# EAGLE design max3002 (EAGLE 5.10)
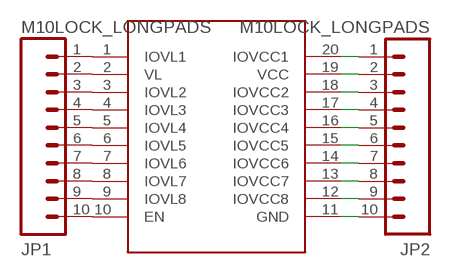
[diagram p0: schematic, sheet 1]

## Parts
JP1  M10LOCK_LONGPADS  [1X10_LOCK_LONGPADS]
JP2  M10LOCK_LONGPADS  [1X10_LOCK_LONGPADS]
U$1  MAX3002  [TSSOP20]

## Nets
N$1: JP1.1 U$1.1(IOVL1)
N$2: JP1.2 U$1.2(VL)
N$3: JP1.3 U$1.3(IOVL2)
N$4: JP1.4 U$1.4(IOVL3)
N$5: JP1.5 U$1.5(IOVL4)
N$6: JP1.6 U$1.6(IOVL5)
N$7: JP1.7 U$1.7(IOVL6)
N$8: JP1.8 U$1.8(IOVL7)
N$9: JP1.9 U$1.9(IOVL8)
N$10: JP1.10 U$1.10(EN)
N$11: JP2.1 U$1.20(IOVCC1)
N$12: JP2.2 U$1.19(VCC)
N$13: JP2.3 U$1.18(IOVCC2)
N$14: JP2.4 U$1.17(IOVCC3)
N$15: JP2.5 U$1.16(IOVCC4)
N$16: JP2.6 U$1.15(IOVCC5)
N$17: JP2.7 U$1.14(IOVCC6)
N$18: JP2.8 U$1.13(IOVCC7)
N$19: JP2.9 U$1.12(IOVCC8)
N$20: JP2.10 U$1.11(GND)

## Library data of the parts
JP1 JP2 = SparkFun:M10: Header 10 Standard 10-pin 0.1" header. Use with straight break away headers (SKU : PRT-00116), right angle break away headers (PRT-00553), swiss pins (PRT-00743), machine pins (PRT-00117), and female headers (PRT-00115).
U$1 = ideabot:MAX3002

## Board
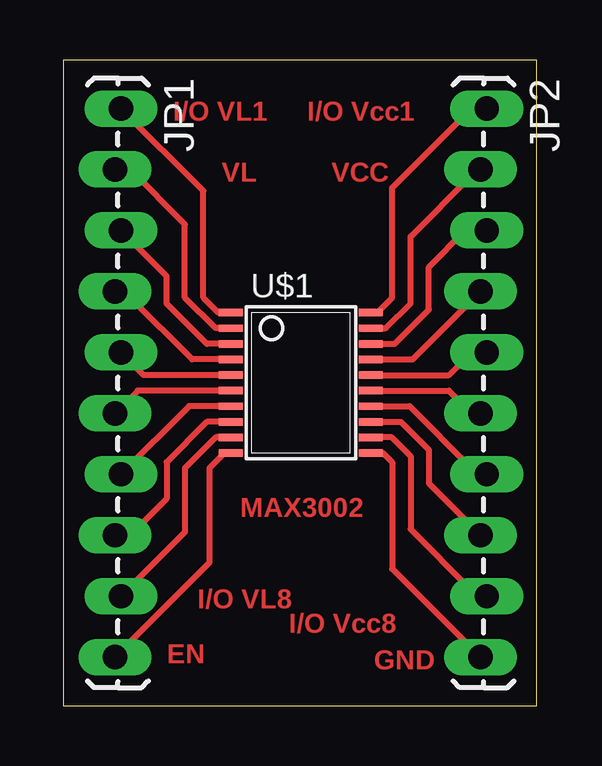
[diagram p1: board, top side]

Size 19.74 x 26.91 mm. Coordinates in mm from the lower left corner, seen from the top.
Outline: 0,0 19.74,0 19.74,26.91 0,26.91 0,0
Copper layers (1*16): Top 0.035mm / dielectric 1.5mm / Bottom 0.035mm
Design rules "default": minimum track width 10mil, minimum drill 24mil, track to track 8mil, track to pad 8mil, pad to pad 8mil, via to via 8mil, smd to smd 8mil, copper to edge 40mil, drill to drill 8mil, minimum pad ring 10mil, minimum via ring 8mil, stop-mask expansion 4mil, vias tented up to drill 0mil, thermal gap 10mil

### Footprints (pad centres in the part's own frame; a part is rotated, then mirrored left to right if it is on the bottom)
1X10_LOCK_LONGPADS = drill 1.016 long: 1 0,0.127; 2 2.54,-0.127; 3 5.08,0.127; 4 7.62,-0.127; 5 10.16,0.127; 6 12.7,-0.127; 7 15.24,0.127; 8 17.78,-0.127; 9 20.32,0.127; 10 22.86,-0.127
TSSOP20 = smd 0.305 x 0.991: 1 -2.925,-2.918; 2 -2.275,-2.918; 3 -1.625,-2.918; 4 -0.975,-2.918; 5 -0.325,-2.918; 6 0.325,-2.918; 7 0.975,-2.918; 8 1.625,-2.918; 9 2.275,-2.918; 10 2.925,-2.918; 11 2.925,2.918; 12 2.275,2.918; 13 1.625,2.918; 14 0.975,2.918; 15 0.325,2.918; 16 -0.325,2.918; 17 -0.975,2.918; 18 -1.625,2.918; 19 -2.275,2.918; 20 -2.925,2.918

### Placement (x,y rotation side)
JP1  2.29,24.89 270 top
JP2  17.53,24.89 270 top
U$1  9.91,13.46 270 top

### Tracks (layer width: path | path; a pad name or v marks a point on that pad's centre or on a via)
N$1
  Top 0.254: U$1.1 6.47,16.39 5.84,17.02 5.84,21.46 JP1.1
N$2
  Top 0.254: U$1.2 6.36,15.74 5.08,17.02 5.08,20.07 2.79,22.35 JP1.2
N$3
  Top 0.254: U$1.3 5.99,15.09 4.32,16.76 4.32,17.91 JP1.3
N$4
  Top 0.254: U$1.4 5.38,14.44 2.79,17.02 2.41,17.02 JP1.4
N$5
  Top 0.254: U$1.5 3.36,13.79 JP1.5
N$6
  Top 0.254: U$1.6 3.1,13.14 JP1.6
N$7
  Top 0.254: U$1.7 5.25,12.49 JP1.7
N$8
  Top 0.254: U$1.8 5.99,11.84 4.32,10.16 4.32,8.64 2.79,7.11 JP1.8
N$9
  Top 0.254: U$1.9 6.36,11.19 5.08,9.91 5.08,7.24 JP1.9
N$10
  Top 0.254: U$1.10 6.73,10.54 6.1,9.91 6.1,5.97 JP1.10
N$11
  Top 0.254: U$1.20 13.09,16.39 13.72,17.02 13.72,21.59 17.02,24.89 JP2.1
N$12
  Top 0.254: U$1.19 13.45,15.74 14.48,16.76 14.48,19.56 17.02,22.1 17.14,22.1 JP2.2
N$13
  Top 0.254: U$1.18 13.82,15.09 15.24,16.51 15.24,18.29 16.76,19.81 JP2.3
N$14
  Top 0.254: U$1.17 14.56,14.44 JP2.4
N$15
  Top 0.254: U$1.16 16.07,13.79 17.02,14.73 JP2.5
N$16
  Top 0.254: U$1.15 16.07,13.14 16.76,12.45 17.14,12.45 JP2.6
N$17
  Top 0.254: U$1.14 14.44,12.49 17.02,9.91 17.4,9.91 JP2.7
N$18
  Top 0.254: U$1.13 14.07,11.84 15.24,10.67 15.24,9.27 JP2.8
N$19
  Top 0.254: U$1.12 13.71,11.19 14.48,10.41 14.48,7.37 17.02,4.83 17.4,4.83 JP2.9
N$20
  Top 0.254: U$1.11 13.34,10.54 13.72,10.16 13.72,5.71 JP2.10

### Text on the board
Top: I/O VL1 | I/O Vcc1 | VL | VCC | MAX3002 | I/O VL8 | I/O Vcc8 | EN | GND